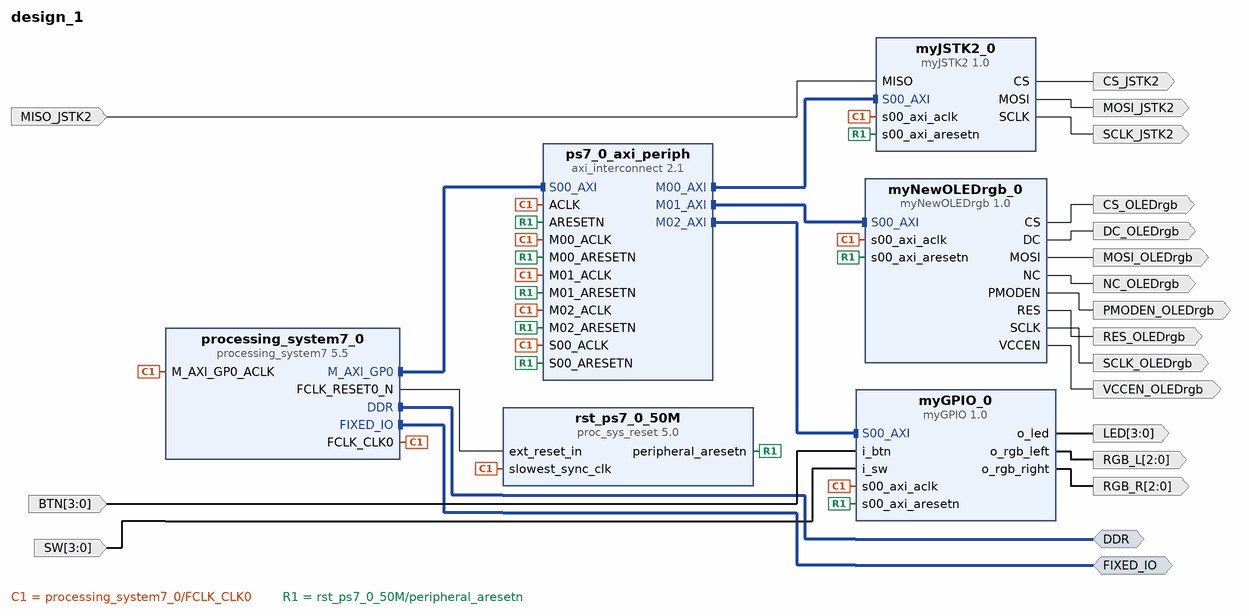
[diagram p0: block diagram of the top level]
# Vivado block design design_1, xc7z020clg400-1, Vivado 2019.2
create_bd_design design_1

create_bd_intf_port -mode Master -vlnv xilinx.com:interface:ddrx_rtl:1.0 DDR
create_bd_intf_port -mode Master -vlnv xilinx.com:display_processing_system7:fixedio_rtl:1.0 FIXED_IO
create_bd_port -dir O -from 3 -to 0 -type data LED
create_bd_port -dir O -from 2 -to 0 -type intr RGB_L
create_bd_port -dir O -from 2 -to 0 -type intr RGB_R
set_property -dict {CONFIG.PortWidth 3} [get_bd_ports RGB_R]
create_bd_port -dir I -from 3 -to 0 -type data BTN
create_bd_port -dir I -from 3 -to 0 -type data SW
create_bd_port -dir I -type data MISO_JSTK2
create_bd_port -dir O -type data MOSI_JSTK2
create_bd_port -dir O -type data SCLK_JSTK2
create_bd_port -dir O -type data CS_JSTK2
create_bd_port -dir O -type data CS_OLEDrgb
create_bd_port -dir O -type data SCLK_OLEDrgb
create_bd_port -dir O -type data DC_OLEDrgb
create_bd_port -dir O -type data MOSI_OLEDrgb
create_bd_port -dir O -type data RES_OLEDrgb
create_bd_port -dir O -type data VCCEN_OLEDrgb
create_bd_port -dir O -type data PMODEN_OLEDrgb
create_bd_port -dir O -type data NC_OLEDrgb

create_bd_cell -type ip -vlnv xilinx.com:user:myGPIO:1.0 myGPIO_0
create_bd_cell -type ip -vlnv xilinx.com:user:myJSTK2:1.0 myJSTK2_0
create_bd_cell -type ip -vlnv xilinx.com:user:myNewOLEDrgb:1.0 myNewOLEDrgb_0
create_bd_cell -type ip -vlnv xilinx.com:ip:processing_system7:5.5 processing_system7_0
set_property -dict [list \
  CONFIG.PCW_APU_PERIPHERAL_FREQMHZ 666.666666 \
  CONFIG.PCW_ENET0_ENET0_IO {MIO 16 .. 27} \
  CONFIG.PCW_ENET0_GRP_MDIO_ENABLE 1 \
  CONFIG.PCW_ENET0_GRP_MDIO_IO {MIO 52 .. 53} \
  CONFIG.PCW_ENET0_PERIPHERAL_ENABLE 1 \
  CONFIG.PCW_ENET0_RESET_ENABLE 0 \
  CONFIG.PCW_ENET_RESET_ENABLE 1 \
  CONFIG.PCW_ENET_RESET_SELECT {Share reset pin} \
  CONFIG.PCW_FPGA0_PERIPHERAL_FREQMHZ 50 \
  CONFIG.PCW_FPGA1_PERIPHERAL_FREQMHZ 50 \
  CONFIG.PCW_GPIO_MIO_GPIO_ENABLE 1 \
  CONFIG.PCW_GPIO_MIO_GPIO_IO MIO \
  CONFIG.PCW_I2C_RESET_ENABLE 1 \
  CONFIG.PCW_PERIPHERAL_BOARD_PRESET part0 \
  CONFIG.PCW_PRESET_BANK1_VOLTAGE {LVCMOS 1.8V} \
  CONFIG.PCW_QSPI_GRP_FBCLK_ENABLE 1 \
  CONFIG.PCW_QSPI_GRP_FBCLK_IO {MIO 8} \
  CONFIG.PCW_QSPI_GRP_SINGLE_SS_ENABLE 1 \
  CONFIG.PCW_QSPI_GRP_SINGLE_SS_IO {MIO 1 .. 6} \
  CONFIG.PCW_QSPI_PERIPHERAL_ENABLE 1 \
  CONFIG.PCW_QSPI_QSPI_IO {MIO 1 .. 6} \
  CONFIG.PCW_SD0_GRP_CD_ENABLE 1 \
  CONFIG.PCW_SD0_GRP_CD_IO {MIO 47} \
  CONFIG.PCW_SD0_GRP_WP_ENABLE 0 \
  CONFIG.PCW_SD0_PERIPHERAL_ENABLE 1 \
  CONFIG.PCW_SD0_SD0_IO {MIO 40 .. 45} \
  CONFIG.PCW_SDIO_PERIPHERAL_FREQMHZ 50 \
  CONFIG.PCW_SINGLE_QSPI_DATA_MODE x4 \
  CONFIG.PCW_UART1_PERIPHERAL_ENABLE 1 \
  CONFIG.PCW_UART1_UART1_IO {MIO 48 .. 49} \
  CONFIG.PCW_UART_PERIPHERAL_FREQMHZ 100 \
  CONFIG.PCW_UIPARAM_DDR_FREQ_MHZ 533.333333 \
  CONFIG.PCW_UIPARAM_DDR_MEMORY_TYPE {DDR 3 (Low Voltage)} \
  CONFIG.PCW_UIPARAM_DDR_PARTNO {MT41K256M16 RE-125} \
  CONFIG.PCW_USB0_PERIPHERAL_ENABLE 1 \
  CONFIG.PCW_USB0_RESET_ENABLE 1 \
  CONFIG.PCW_USB0_RESET_IO {MIO 46} \
  CONFIG.PCW_USB0_USB0_IO {MIO 28 .. 39} \
  CONFIG.PCW_USB_RESET_ENABLE 1 \
  CONFIG.PCW_USB_RESET_SELECT {Share reset pin} \
] [get_bd_cells processing_system7_0]
# 498 more settings of processing_system7_0 are not shown: defaults, MIO pin electricals, DDR timing, and values the tool derives
create_bd_cell -type ip -vlnv xilinx.com:ip:axi_interconnect:2.1 ps7_0_axi_periph
set_property -dict {CONFIG.NUM_MI 3} [get_bd_cells ps7_0_axi_periph]
create_bd_cell -type ip -vlnv xilinx.com:ip:proc_sys_reset:5.0 rst_ps7_0_50M

# ---- connections ----

connect_bd_intf_net [get_bd_intf_pins ps7_0_axi_periph/M01_AXI] [get_bd_intf_pins myNewOLEDrgb_0/S00_AXI]
connect_bd_intf_net [get_bd_intf_pins processing_system7_0/M_AXI_GP0] [get_bd_intf_pins ps7_0_axi_periph/S00_AXI]
connect_bd_intf_net [get_bd_intf_pins ps7_0_axi_periph/M00_AXI] [get_bd_intf_pins myJSTK2_0/S00_AXI]
connect_bd_intf_net [get_bd_intf_ports DDR] [get_bd_intf_pins processing_system7_0/DDR]
connect_bd_intf_net [get_bd_intf_pins ps7_0_axi_periph/M02_AXI] [get_bd_intf_pins myGPIO_0/S00_AXI]
connect_bd_intf_net [get_bd_intf_ports FIXED_IO] [get_bd_intf_pins processing_system7_0/FIXED_IO]
connect_bd_net [get_bd_pins processing_system7_0/FCLK_CLK0] \
  [get_bd_pins myGPIO_0/s00_axi_aclk] [get_bd_pins myJSTK2_0/s00_axi_aclk] [get_bd_pins myNewOLEDrgb_0/s00_axi_aclk] \
  [get_bd_pins processing_system7_0/M_AXI_GP0_ACLK] [get_bd_pins ps7_0_axi_periph/ACLK] \
  [get_bd_pins ps7_0_axi_periph/S00_ACLK] [get_bd_pins ps7_0_axi_periph/M00_ACLK] [get_bd_pins ps7_0_axi_periph/M01_ACLK] \
  [get_bd_pins ps7_0_axi_periph/M02_ACLK] [get_bd_pins rst_ps7_0_50M/slowest_sync_clk]
connect_bd_net [get_bd_pins processing_system7_0/FCLK_RESET0_N] [get_bd_pins rst_ps7_0_50M/ext_reset_in]
connect_bd_net [get_bd_pins rst_ps7_0_50M/peripheral_aresetn] \
  [get_bd_pins myGPIO_0/s00_axi_aresetn] [get_bd_pins myJSTK2_0/s00_axi_aresetn] [get_bd_pins myNewOLEDrgb_0/s00_axi_aresetn] \
  [get_bd_pins ps7_0_axi_periph/ARESETN] [get_bd_pins ps7_0_axi_periph/S00_ARESETN] \
  [get_bd_pins ps7_0_axi_periph/M00_ARESETN] [get_bd_pins ps7_0_axi_periph/M01_ARESETN] \
  [get_bd_pins ps7_0_axi_periph/M02_ARESETN]
connect_bd_net [get_bd_pins myGPIO_0/o_rgb_left] [get_bd_ports RGB_L]
connect_bd_net [get_bd_pins myGPIO_0/o_rgb_right] [get_bd_ports RGB_R]
connect_bd_net [get_bd_pins myGPIO_0/o_led] [get_bd_ports LED]
connect_bd_net [get_bd_ports BTN] [get_bd_pins myGPIO_0/i_btn]
connect_bd_net -net SW1_1 [get_bd_ports SW] [get_bd_pins myGPIO_0/i_sw]
connect_bd_net -net MISO_JSTK2_1 [get_bd_ports MISO_JSTK2] [get_bd_pins myJSTK2_0/MISO]
connect_bd_net [get_bd_pins myJSTK2_0/MOSI] [get_bd_ports MOSI_JSTK2]
connect_bd_net [get_bd_pins myJSTK2_0/SCLK] [get_bd_ports SCLK_JSTK2]
connect_bd_net [get_bd_pins myJSTK2_0/CS] [get_bd_ports CS_JSTK2]
connect_bd_net [get_bd_pins myNewOLEDrgb_0/CS] [get_bd_ports CS_OLEDrgb]
connect_bd_net [get_bd_pins myNewOLEDrgb_0/SCLK] [get_bd_ports SCLK_OLEDrgb]
connect_bd_net [get_bd_pins myNewOLEDrgb_0/DC] [get_bd_ports DC_OLEDrgb]
connect_bd_net [get_bd_pins myNewOLEDrgb_0/MOSI] [get_bd_ports MOSI_OLEDrgb]
connect_bd_net [get_bd_pins myNewOLEDrgb_0/NC] [get_bd_ports NC_OLEDrgb]
connect_bd_net [get_bd_pins myNewOLEDrgb_0/PMODEN] [get_bd_ports PMODEN_OLEDrgb]
connect_bd_net [get_bd_pins myNewOLEDrgb_0/VCCEN] [get_bd_ports VCCEN_OLEDrgb]
connect_bd_net [get_bd_pins myNewOLEDrgb_0/RES] [get_bd_ports RES_OLEDrgb]

# ---- address map ----
assign_bd_address -offset 0x43C00000 -range 64K -target_address_space [get_bd_addr_spaces processing_system7_0/Data] [get_bd_addr_segs myJSTK2_0/S00_AXI/S00_AXI_reg]
assign_bd_address -offset 0x43C10000 -range 64K -target_address_space [get_bd_addr_spaces processing_system7_0/Data] [get_bd_addr_segs myNewOLEDrgb_0/S00_AXI/S00_AXI_reg]
assign_bd_address -offset 0x43C20000 -range 64K -target_address_space [get_bd_addr_spaces processing_system7_0/Data] [get_bd_addr_segs myGPIO_0/S00_AXI/S00_AXI_reg]

validate_bd_design
save_bd_design
